# Altium schematic sheet Power.SchDoc: Trial Run
size A4; DocumentNumber: 1; Revision: 1.0; SheetNumber: 1; SheetTotal: 2
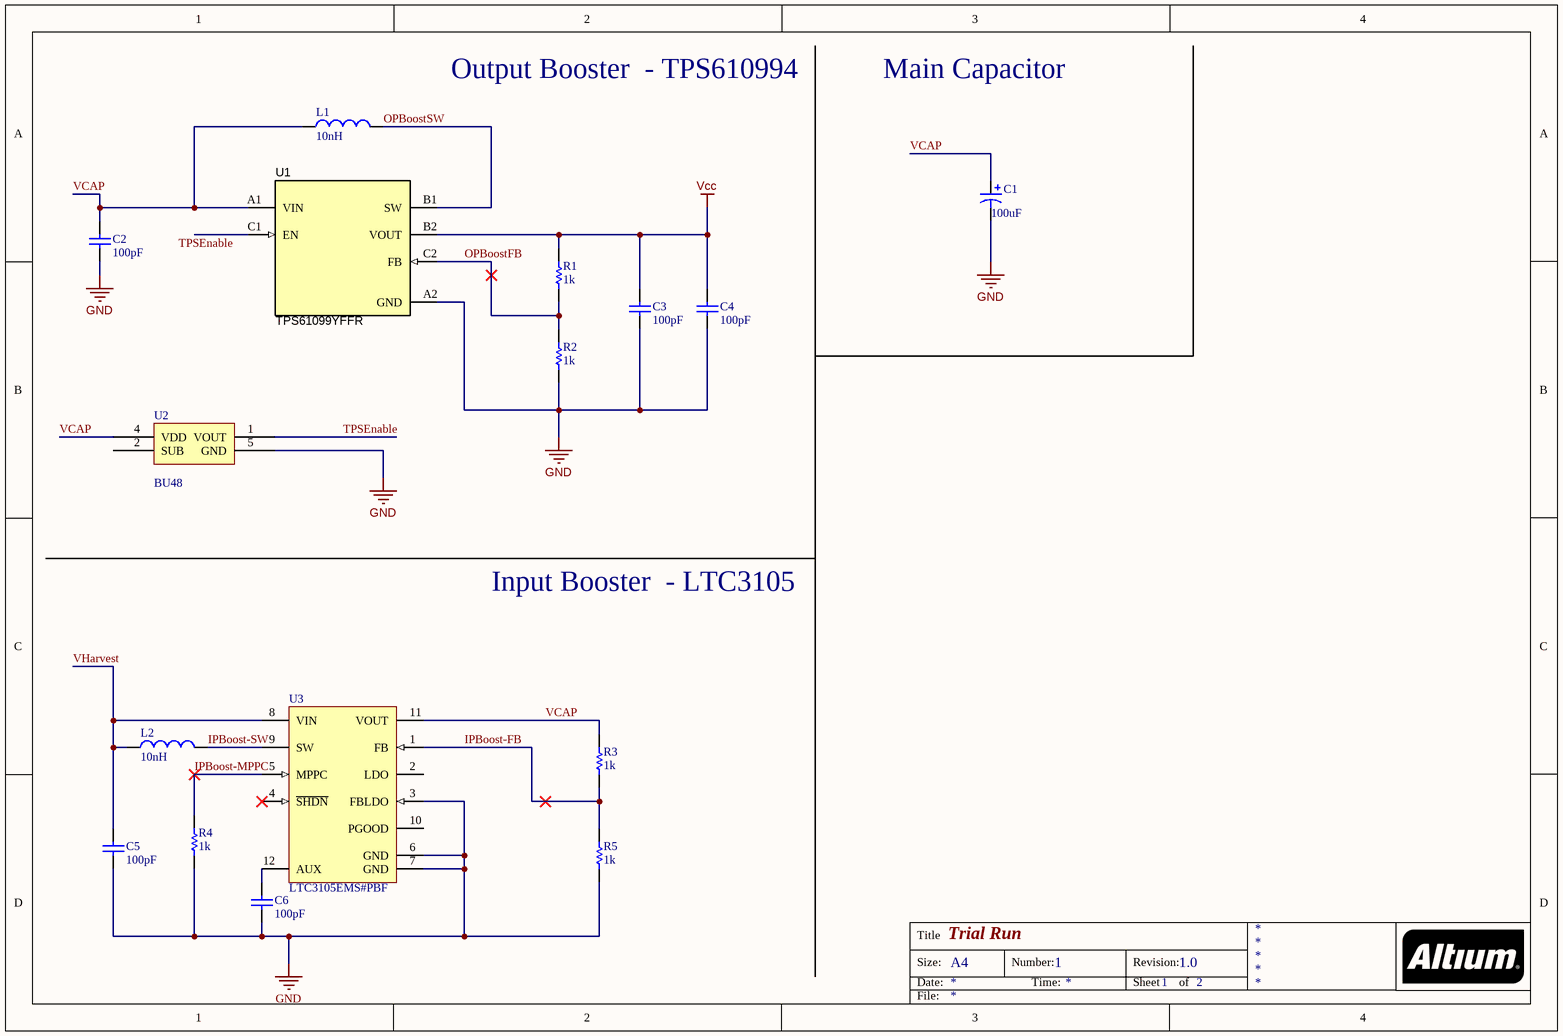
[diagram p0: Power.SchDoc]

## Parts
C1  value 100uF  (hidden comment: Cap - Polarized)
C2  value 100pF  [0402]  (hidden comment: Cap)
C3  value 100pF  [0402]  (hidden comment: Cap)
C4  value 100pF  [0402]  (hidden comment: Cap)
C5  value 100pF  [0402]  (hidden comment: Cap)
C6  value 100pF  [0402]  (hidden comment: Cap)
L1  value 10nH  [0402]  (hidden comment: Ind)
L2  value 10nH  [0402]  (hidden comment: Ind)
R1  value 1k  [0402]  (hidden comment: Res)
R2  value 1k  [0402]  (hidden comment: Res)
R3  value 1k  [0402]  (hidden comment: Res)
R4  value 1k  [0402]  (hidden comment: Res)
R5  value 1k  [0402]  (hidden comment: Res)
U1  TPS61099YFFR  [YFF0006AFAD]
U2  BU48  [VSOF5]
U3  LTC3105EMS#PBF  [LT-MS-12_N]

## Nets
GND: C1.2 C2.1 C3.1 C4.1 C5.1 C6.1 R2.1 R4.2 R5.2 U1.A2(GND) U2.5(GND) U3.3(FBLDO) U3.6(GND) U3.7(GND)
Vcc: C3.2 C4.2 R1.2 U1.B2(VOUT)
IPBoost-FB: R3.2 R5.1 U3.1(FB)
IPBoost-MPPC: R4.1 U3.5(MPPC)
IPBoost-SW: L2.2 U3.9(SW)
OPBoostFB: R1.1 R2.2 U1.C2(FB)
OPBoostSW: L1.2 U1.B1(SW)
TPSEnable: U1.C1(EN) U2.1(VOUT)
VCAP: C1.1 C2.2 L1.1 R3.1 U1.A1(VIN) U2.4(VDD) U3.11(VOUT)
VHarvest: C5.2 L2.1 U3.8(VIN)
NetC6_2: C6.2 U3.12(AUX)

Not connected (* = marked no-connect by the designer): U2 2(SUB); U3 2(LDO) 4(~{SHDN})* 10(PGOOD)

## Notes on the sheet
- Output Booster  - TPS610994
- Main Capacitor
- Input Booster  - LTC3105
- Title
- Size:
- Date:
- A4
- Number:
- Time:
- Revision:
- Sheet
- of
- File:

## Library data of the parts
C1 = Cap - Polarized: Polarized Capacitor; Digi-Key Part Number: *; Manufacturer Part Number: *; Manufacturer: *; Rating: *; Note: *
C2-C6 = Cap: Ceramic Capacitor (Surface Mount); Manufacturer: Generic Ceramic Chip Cap (TBD); Digi-Key Part Number: *; Manufacturer Part Number: *; Rating: *; Note: *; Distributor: *; Distributor Part Number: *
L1 L2 = Ind: Inductor (Surface Mount); Manufacturer: *; Digi-Key Part Number: *; Manufacturer Part Number: *; Rating: *; Note: *
R1-R5 = Res: Chip Resistor (Surface Mount); Manufacturer: Generic Chip Res (TBD); Manufacturer Part Number: *; Digi-Key Part Number: *; Rating: *; Note: *
U1 = TPS61099YFFR: Synchronous Boost Converter with 800 nA Ultra-Low Quiescent Current, YFF0006AFAD (DSBGA-6); Alternate PartNumber: TPS61099YFFT; Manufacturer: Texas Instruments; SymbolCreator: Altium; SizeArea_mm2: 1.083784; SizeAreaWB_mm2: 4.193784; SizeX_mm: 0.884; SizeY_mm: 1.226; SizeZ_mm: 0.625; CompType: IC; U/M: EA; SymbolVersion: 2017-01-12; PartNumber: TPS61099YFFR; PackageReference: YFF0006AFAD; PackageDescription: DSBGA-6; MountType: SMT; ComponentLink1Description: Datasheet Link; ComponentLink1URL: http://www.ti.com/lit/ds/symlink/tps61099.pdf; Publisher: Texas Instruments; LatestRevisionDate: 2017-04-10; Alternate Manufacturer: Texas Instruments
U2 = BU48: IC DETECTOR OPEN-DRAIN; Name: BU48
U3 = CMP-0473-00104-1: 400 mA Step-Up DC/DC Converter with Maximum Power Point Control and 250 mV Start-Up, 12-pin SOP (MS-12), -40 to 85 degC, Pb-Free; Manufacturer: Linear Technology; Number of Outputs: 1; Vin Min(V): 0.225; Topology: Boost; Vin Max(V): 5; Vout Max(V): 5.25; Energy Source: Solar; Mounting Technology: Surface Mount; PackageVersion: Rev. A, 05/2013; PartNumber: LTC3105EMS#PBF; RoHS: TRUE; PackageDescription: 12-Pin Plastic MSOP, Body 4.039 x 3 mm, Pitch 0.65 mm; ComponentLink1Description: Manufacturer URL; DatasheetVersion: Rev. A; ComponentLink1URL: http://www.linear.com/; ComponentLink3Description: Package Specification; ComponentLink2URL: http://cds.linear.com/docs/en/datasheet/3105fa.pdf; ComponentLink3URL: http://cds.linear.com/docs/en/packaging/05081668_A_MS12.pdf; PackageReference: MS-12; ComponentLink2Description: Datasheet